# EAGLE design OBD (EAGLE 5.10)
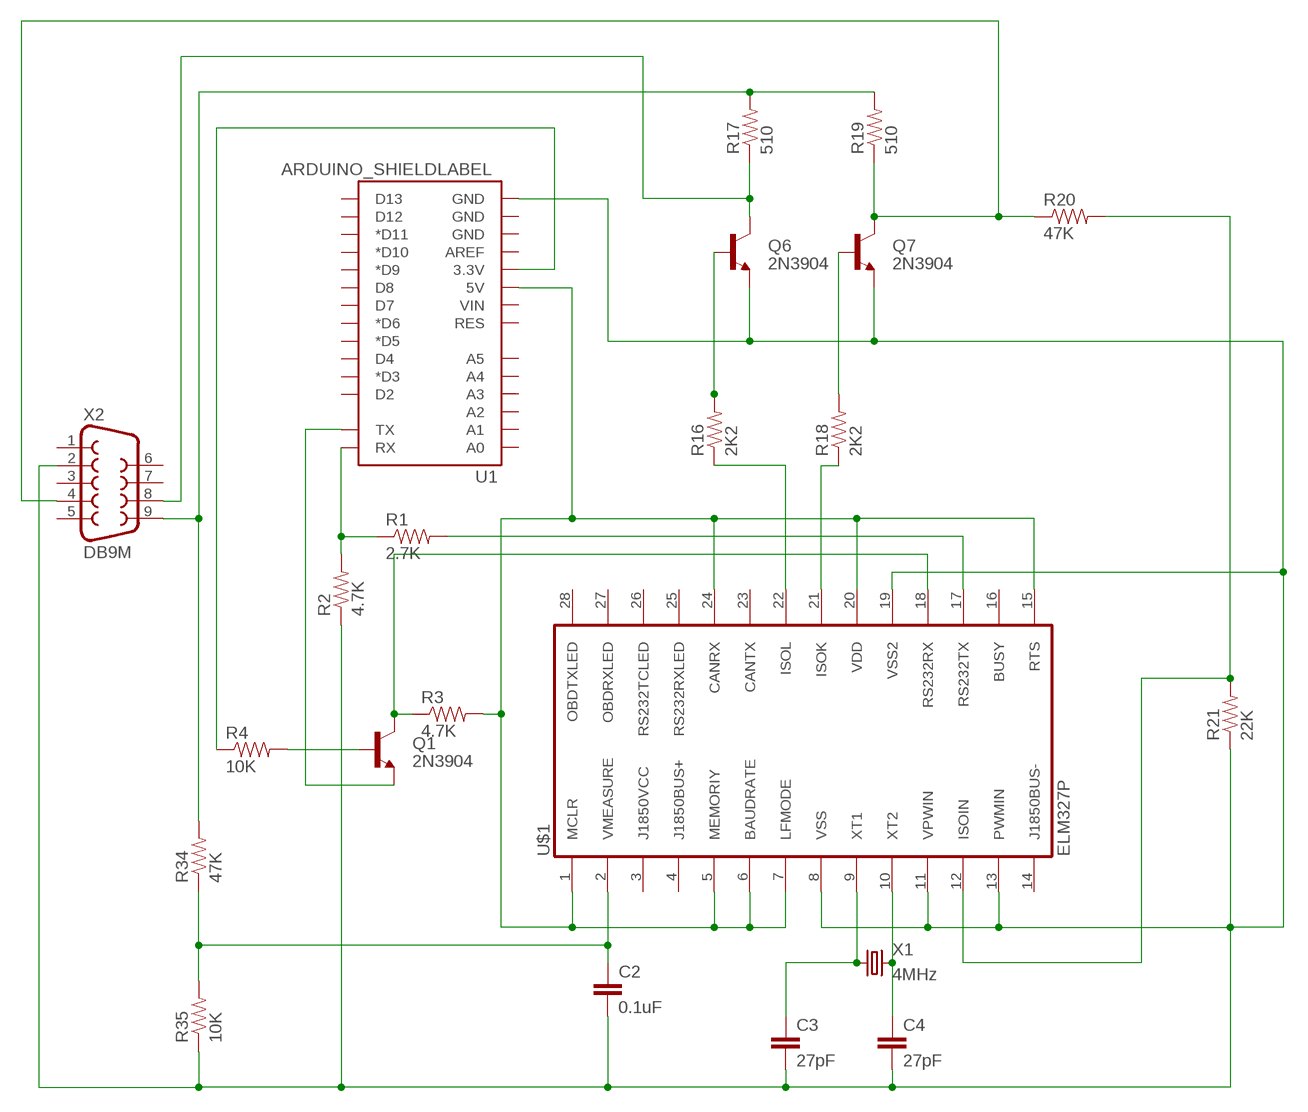
[diagram p0: schematic, sheet 1]

## Parts
C2  0.1uF  CAP_  [AXIAL-5MM]
C3  27pF  CAP_  [AXIAL-5MM]
C4  27pF  CAP_  [AXIAL-5MM]
Q1  2N3904  TRANSISTOR_NPNTO92  [TO-92]
Q6  2N3904  TRANSISTOR_NPNTO92  [TO-92]
Q7  2N3904  TRANSISTOR_NPNTO92  [TO-92]
R1  2.7K  RESISTORPTH1  [AXIAL-0.3]
R2  4.7K  RESISTORPTH1  [AXIAL-0.3]
R3  4.7K  RESISTORPTH1  [AXIAL-0.3]
R4  10K  RESISTORPTH1  [AXIAL-0.3]
R16  2K2  RESISTORPTH1  [AXIAL-0.3]
R17  510  RESISTORPTH1  [AXIAL-0.3]
R18  2K2  RESISTORPTH1  [AXIAL-0.3]
R19  510  RESISTORPTH1  [AXIAL-0.3]
R20  47K  RESISTORPTH1  [AXIAL-0.3]
R21  22K  RESISTORPTH1  [AXIAL-0.3]
R34  47K  RESISTORPTH1  [AXIAL-0.3]
R35  10K  RESISTORPTH1  [AXIAL-0.3]
U1  ARDUINO_SHIELDLABEL  [DUEMILANOVE_SHIELD]
U$1  ELM327P  [ELM327P]
X1  4MHz  CRYSTALHC49UV  [HC49U-V]
X2  DB9M  DB9  [DB9]

## Nets
N$1: C3.P$1 U$1.9(XT1) X1.1
N$2: C4.P$1 U$1.10(XT2) X1.2
N$3: R16.P$1 U$1.22(ISOL)
N$4: Q6.2(B) R16.P$2
N$6: C2.P$1 R34.P$1 R35.P$2 U$1.2(VMEASURE)
N$7: R18.P$1 U$1.21(ISOK)
N$8: Q7.3(C) R19.P$1 R20.P$1 X2.4
N$9: R3.P$2 U1.5V U$1.1(MCLR) U$1.5(MEMORIY) U$1.6(BAUDRATE) U$1.7(LFMODE) U$1.15(RTS) U$1.20(VDD) U$1.24(CANRX)
N$10: Q7.2(B) R18.P$2
N$11: C2.P$2 C3.P$2 C4.P$2 Q6.1(E) Q7.1(E) R2.P$1 R21.P$1 R35.P$1 U1.GND@0(GND) U$1.8(VSS) U$1.11(VPWIN) U$1.13(PWMIN) U$1.19(VSS2) X2.2
N$12: Q6.3(C) R17.P$1 X2.8
N$13: R1.P$2 U$1.17(RS232TX)
N$14: R17.P$2 R19.P$2 R34.P$2 X2.9
N$16: Q1.2(B) R4.P$2
N$17: R20.P$2 R21.P$2 U$1.12(ISOIN)
N$18: Q1.1(E) U1.TX
N$19: R1.P$1 R2.P$2 U1.RX
N$20: R4.P$1 U1.3.3V
N$21: Q1.3(C) R3.P$1 U$1.18(RS232RX)
Unconnected: U1.A0 U1.A1 U1.A2 U1.A3 U1.A4 U1.A5 U1.AREF U1.D2 U1.D3(*D3) U1.D4 U1.D5(*D5) U1.D6(*D6) U1.D7 U1.D8 U1.D9(*D9) U1.D10(*D10) U1.D11(*D11) U1.D12 U1.D13 U1.GND@1(GND) U1.GND@2(GND) U1.RES U1.VIN U$1.3(J1850VCC) U$1.4(J1850BUS+) U$1.14(J1850BUS-) U$1.16(BUSY) U$1.23(CANTX) U$1.25(RS232RXLED) U$1.26(RS232TCLED) U$1.27(OBDRXLED) U$1.28(OBDTXLED) X2.1 X2.3 X2.5 X2.6 X2.7

## Library data of the parts
C2-C4 = SparkFun:CAP: Capacitor Standard 0603 ceramic capacitor, and 0.1" leaded capacitor.
Q1 Q6 Q7 = SparkFun:TRANSISTOR_NPN: Transistor NPN BJT configuration in SOT23 package. MMBT2222 is the common NPN we use. Double check BCE configuration again layout.
R1-R4 R16-R21 R34 R35 = SparkFun:RESISTOR: Resistor Basic schematic elements and footprints for 0603, 1206, and PTH 1/10th watt (small) resistors.
U1 = SparkFun:ARDUINO_SHIELD
U$1 = elm:ELM327P
X1 = SparkFun:CRYSTAL: Crystals Various standard crystals. Proven footprints. Spark Fun Electronics SKU : COM-00534
X2 = SparkFun:DB9: DB9 Connector Standard DB9 (D-Sub 9) serial connector. Can be used for CAN bus as well as RS485 and RS232. Footprint production proven. Spark Fun Electronics SKU : PRT-00429

## Board
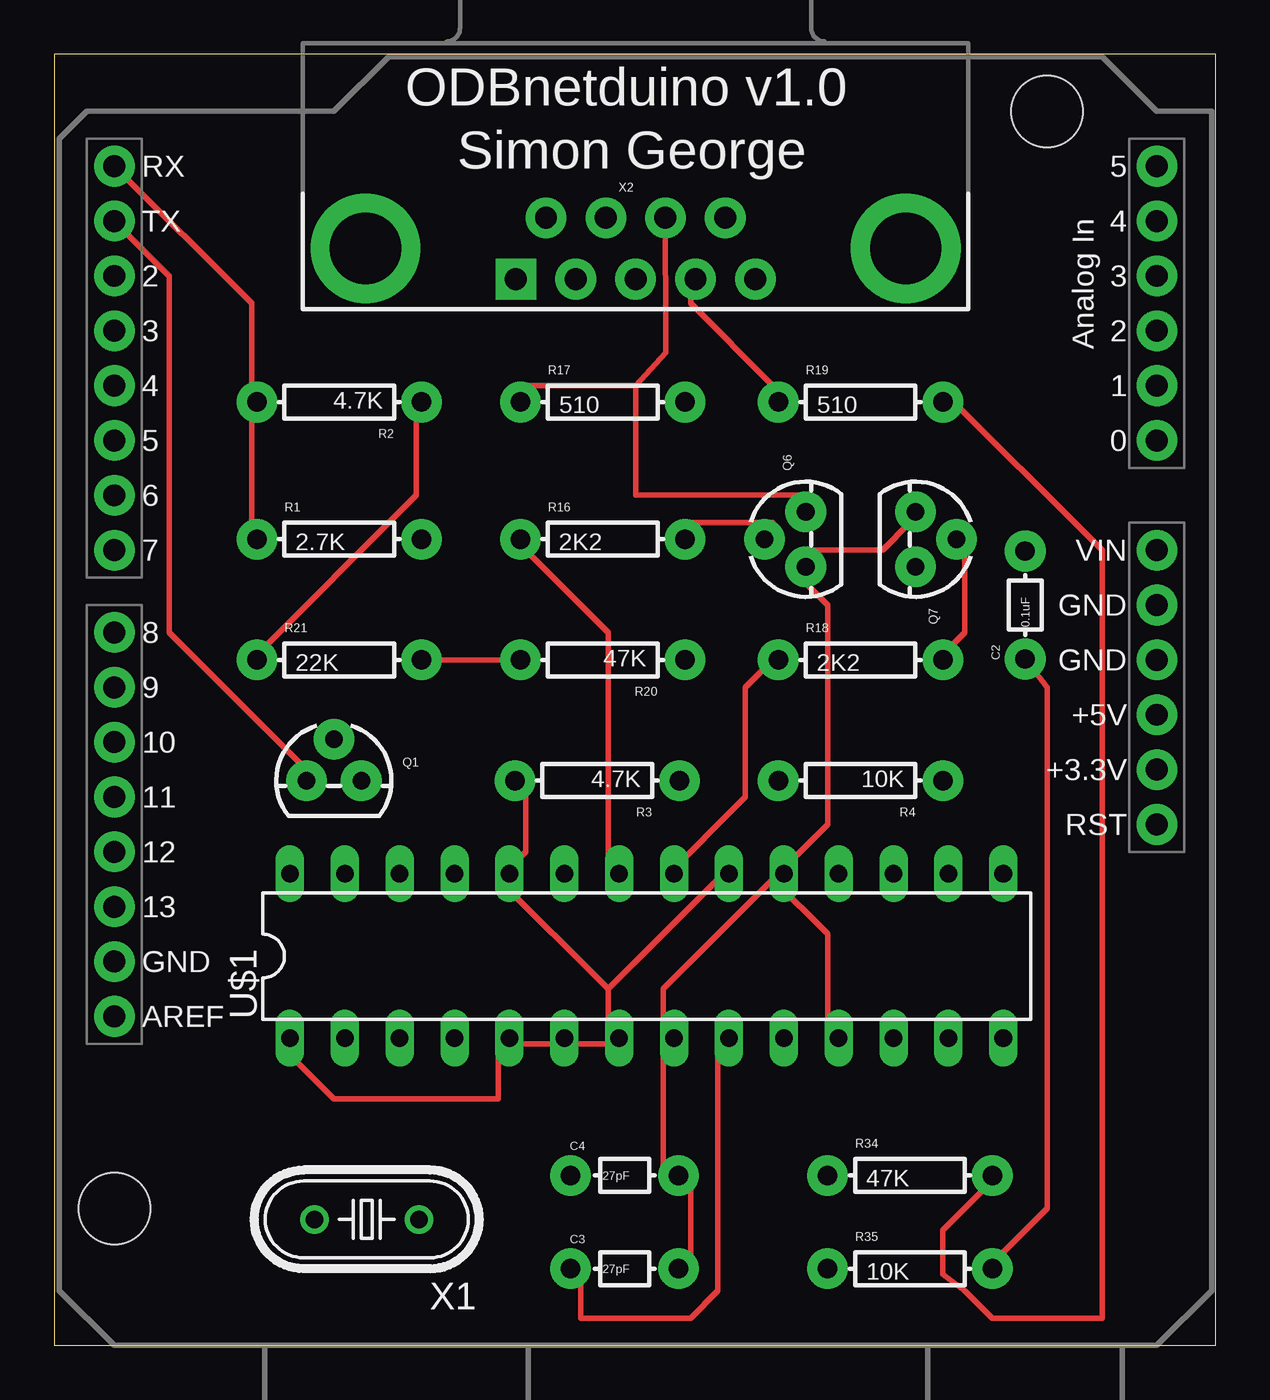
[diagram p1: board, top side]
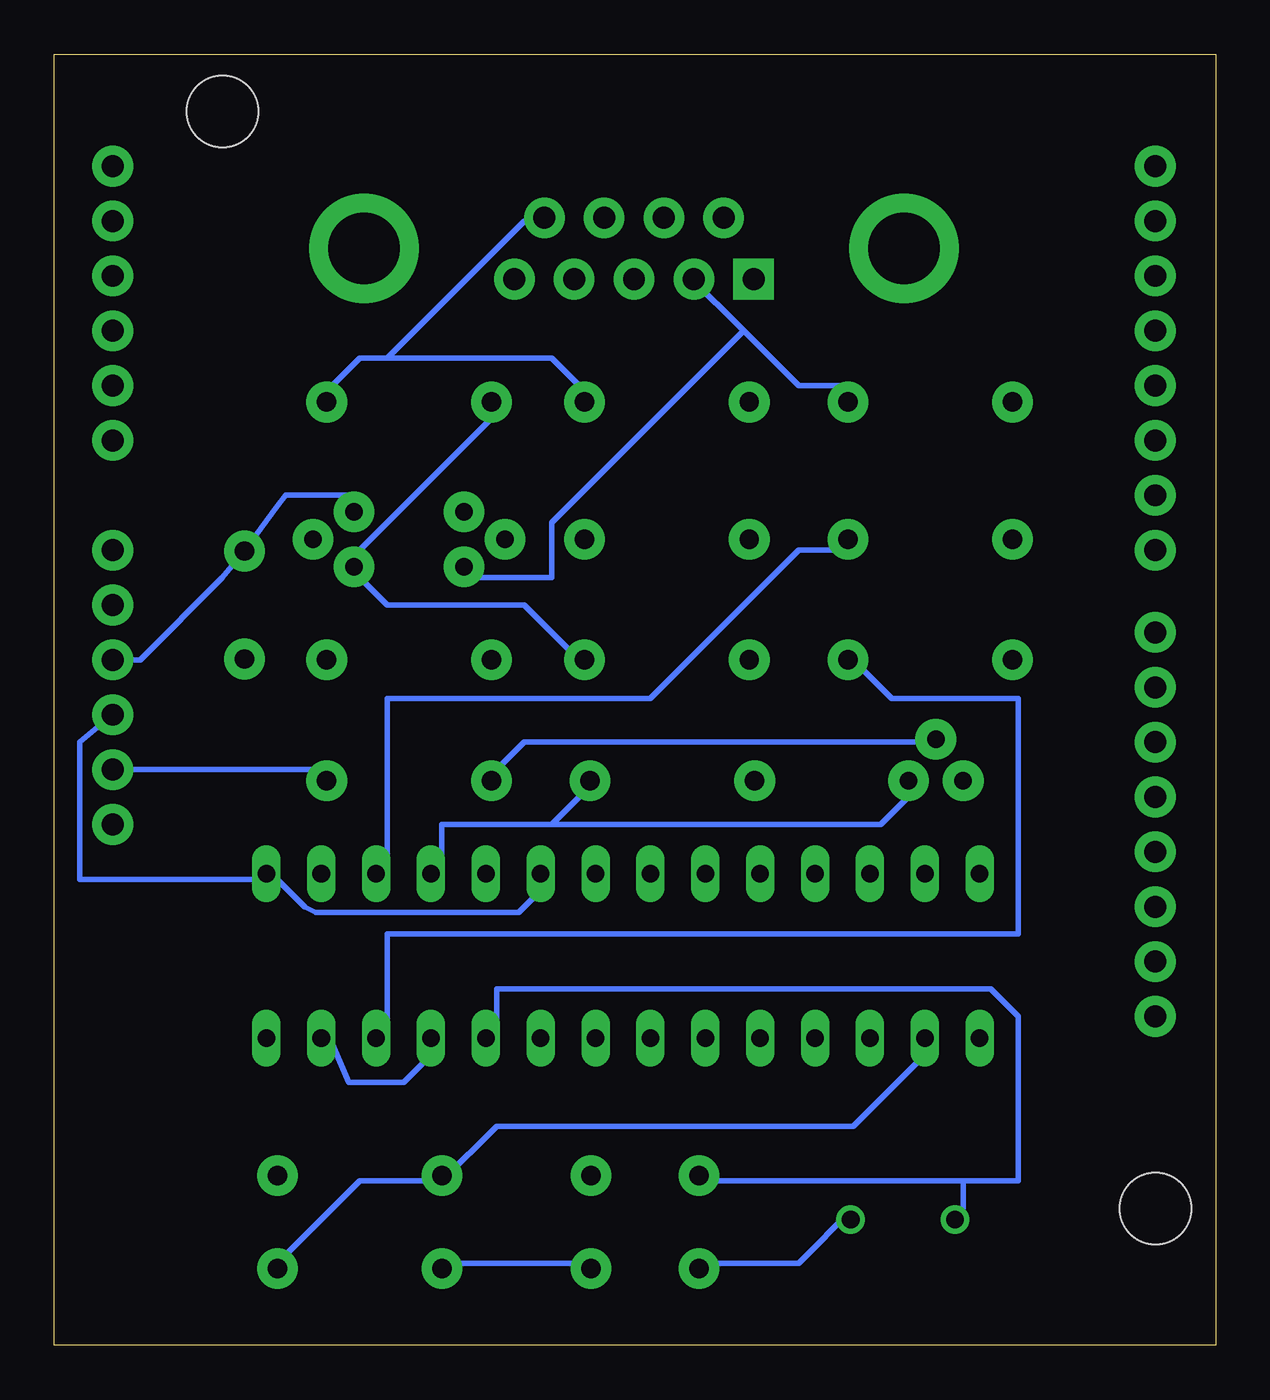
[diagram p2: board, bottom side, seen from below]

Size 53.77 x 59.81 mm. Coordinates in mm from the lower left corner, seen from the top.
Outline: 0,0 53.77,0 53.77,59.81 0,59.81 0,0
Copper layers (1*16): Top 0.035mm / dielectric 1.5mm / Bottom 0.035mm
Design rules "10mils": minimum track width 10mil, minimum drill 24mil, track to track 10mil, track to pad 10mil, pad to pad 10mil, via to via 10mil, smd to smd 10mil, copper to edge 40mil, drill to drill 10mil, minimum pad ring 10mil, minimum via ring 8mil, stop-mask expansion 0mil, vias tented up to drill 0mil, thermal gap 10mil

### Footprints (pad centres in the part's own frame; a part is rotated, then mirrored left to right if it is on the bottom)
AXIAL-5MM = drill 0.9 pad 1.88 round: P$1 -2.5,0; P$2 2.5,0
TO-92 = drill 0.813 pad 1.88 round: 1 -1.27,0; 2 0,1.905; 3 1.27,0
AXIAL-0.3 = drill 0.9 pad 1.88 round: P$1 -3.81,0; P$2 3.81,0
DUEMILANOVE_SHIELD = drill 1.016 pad 1.88 round: 3.3V 50.8,26.67; 5V 50.8,29.21; A0 50.8,41.91; A1 50.8,44.45; A2 50.8,46.99; A3 50.8,49.53; A4 50.8,52.07; A5 50.8,54.61; AREF 2.54,15.24; D2 2.54,49.53; D3 2.54,46.99; D4 2.54,44.45; D5 2.54,41.91; D6 2.54,39.37; D7 2.54,36.83; D8 2.54,33.02; D9 2.54,30.48; D10 2.54,27.94; D11 2.54,25.4; D12 2.54,22.86; D13 2.54,20.32; GND@0 50.8,31.75; GND@1 50.8,34.29; GND@2 2.54,17.78; RES 50.8,24.13; RX 2.54,54.61; TX 2.54,52.07; VIN 50.8,36.83 | hole 3.302: 45.72,57.15; 2.54,6.35
ELM327P = drill 0.813 long: 1 -15.24,-1.27; 2 -12.7,-1.27; 3 -10.16,-1.27; 4 -7.62,-1.27; 5 -5.08,-1.27; 6 -2.54,-1.27; 7 0,-1.27; 8 2.54,-1.27; 9 5.08,-1.27; 10 7.62,-1.27; 11 10.16,-1.27; 12 12.7,-1.27; 13 15.24,-1.27; 14 17.78,-1.27; 15 17.78,6.35; 16 15.24,6.35; 17 12.7,6.35; 18 10.16,6.35; 19 7.62,6.35; 20 5.08,6.35; 21 2.54,6.35; 22 0,6.35; 23 -2.54,6.35; 24 -5.08,6.35; 25 -7.62,6.35; 26 -10.16,6.35; 27 -12.7,6.35; 28 -15.24,6.35
HC49U-V = drill 0.813 round: 1 -2.413,0; 2 2.413,0
DB9 = drill 1.016 pad 1.88 square: 1 -5.54,-1.42 | drill 1.016 pad 1.88 round: 2 -2.77,-1.42; 3 0,-1.42; 4 2.77,-1.42; 5 5.54,-1.42; 6 -4.15,1.42; 7 -1.38,1.42; 8 1.38,1.42; 9 4.15,1.42 | drill 3.302 pad 5.08 round: G1 -12.5,0; G2 12.5,0

### Placement (x,y rotation side)
C2  44.96,34.29 90 top
C3  26.42,3.56 0 top
C4  26.42,7.87 0 top
Q1  12.95,26.16 0 top
Q6  34.8,37.34 90 top
Q7  39.88,37.34 270 top
R1  13.21,37.34 0 top
R2  13.21,43.69 180 top
R3  25.15,26.16 180 top
R4  37.34,26.16 180 top
R16  25.4,37.34 0 top
R17  25.4,43.69 0 top
R18  37.34,31.75 0 top
R19  37.34,43.69 0 top
R20  25.4,31.75 180 top
R21  13.21,31.75 0 top
R34  39.62,7.87 0 top
R35  39.62,3.56 0 top
U1  0.25,0 0 top
U$1  26.16,15.49 0 top
X1  14.48,5.84 180 top
X2  26.92,50.8 0 top

### Tracks (layer width: path | path; a pad name or v marks a point on that pad's centre or on a via)
N$1
  Top 0.254: U$1.9 30.73,13.97 30.73,2.54 29.46,1.27 24.38,1.27 24.38,3.81 C3.P$1
  Bottom 0.254: X1.1 16.76,6.35 19.3,3.81 23.11,3.81 C3.P$1
N$2
  Bottom 0.254: 11.68,7.62 9.14,7.62 9.14,15.24 10.41,16.51 33.27,16.51 33.27,13.97 U$1.10 | 11.68,7.62 23.11,7.62 C4.P$1 | 11.68,7.62 11.68,6.35 X1.2
N$3
  Top 0.254: U$1.22 25.65,21.59 25.65,33.02 21.84,36.83 R16.P$1
N$4
  Top 0.254: R16.P$2 29.46,38.1 33.27,38.1 Q6.2
N$6
  Top 0.254: C2.P$1 45.97,30.48 45.97,6.35 43.43,3.81 R35.P$2
  Bottom 0.254: 35.81,7.62 33.27,10.16 16.76,10.16 12.95,13.97 U$1.2 | 35.81,7.62 39.62,7.62 43.43,3.81 R35.P$2 | 35.81,7.62 R34.P$1
N$7
  Top 0.254: U$1.21 28.19,21.59 32,25.4 32,30.48 33.27,31.75 R18.P$1
N$8
  Top 0.254: R19.P$1 33.27,44.45 29.46,48.26 29.46,49.53 X2.4
  Bottom 0.254: R20.P$1 29.46,31.75 32,34.29 38.35,34.29 39.62,35.56 Q7.3 39.62,36.83 33.27,43.18 R19.P$1
N$9
  Top 0.254: 20.57,21.59 21.84,22.86 21.84,25.4 R3.P$2 | 20.57,13.97 20.57,11.43 12.95,11.43 10.41,13.97 U$1.1 | 20.57,13.97 23.11,13.97 | 20.57,13.97 U$1.5 | 23.11,13.97 25.65,13.97 | 23.11,13.97 U$1.6 | 25.65,16.51 30.73,21.59 U$1.20 | 25.65,13.97 25.65,16.51 | 25.65,13.97 U$1.7 | 25.65,16.51 20.57,21.59 | 20.57,21.59 U$1.24
  Bottom 0.254: 43.43,21.59 42.16,20.32 41.66,20.07 32.26,20.07 30.73,21.59 U$1.20 | 43.43,21.59 U$1.15 | U1.5V 52.58,27.94 52.58,21.59 43.43,21.59
N$10
  Top 0.254: R18.P$2 40.89,31.75 42.16,33.02 42.16,36.83 Q7.2
N$11
  Top 0.254: R21.P$1 9.14,31.75 16.76,39.37 16.76,43.18 R2.P$1 | Q7.1 39.62,38.1 38.35,36.83 34.54,36.83 Q6.1 34.54,35.56 35.81,34.29 35.81,24.13 33.27,21.59 | 33.27,21.59 35.81,19.05 35.81,13.97 U$1.11 | 28.19,13.97 28.19,7.62 C4.P$2 29.46,7.62 29.46,3.81 C3.P$2 | 33.27,21.59 28.19,16.51 28.19,13.97 | 28.19,13.97 U$1.8 | 33.27,21.59 U$1.19
  Bottom 0.254: 21.84,46.99 19.3,44.45 16.76,44.45 R2.P$1 | 21.84,46.99 24.38,49.53 X2.2 | U1.GND@0 49.78,31.75 45.97,35.56 C2.P$2 43.43,38.86 43.05,39.37 39.88,39.37 Q7.1 | U$1.11 35.81,13.97 37.59,12.19 40.13,12.19 40.89,13.97 U$1.13 | R35.P$1 35.81,3.81 29.46,3.81 C3.P$2 | 21.84,46.99 30.73,38.1 30.73,35.56 34.54,35.56 Q6.1
N$12
  Top 0.254: 26.92,44.45 21.84,44.45 R17.P$1 | 28.19,52.07 X2.8 28.32,46.86 28.32,45.97 26.92,44.45 | 26.92,44.45 26.92,39.37 34.54,39.37 Q6.3
N$13
  Bottom 0.254: U$1.17 38.35,21.59 38.35,29.97 26.16,29.97 19.3,36.83 16.76,36.83 R1.P$2
N$14
  Top 0.254: R34.P$2 43.43,7.62 41.15,5.33 41.15,3.3 42.16,2.54 43.43,1.27 48.51,1.27 48.51,36.83 40.89,44.45 R19.P$2
  Bottom 0.254: 38.35,45.72 39.62,45.72 40.89,44.45 R19.P$2 | 38.35,45.72 30.73,45.72 29.46,44.45 R17.P$2 | 38.35,45.72 32,52.07 X2.9
N$16
  Bottom 0.254: Q1.2 12.95,27.94 32,27.94 33.27,26.67 R4.P$2
N$17
  Top 0.254: 21.84,31.75 R20.P$2 R21.P$2 16.76,31.75
  Bottom 0.254: U$1.12 38.35,13.97 38.35,19.05 9.14,19.05 9.14,29.97 14.99,29.97 16.76,31.75 R21.P$2
N$18
  Top 0.254: Q1.1 11.68,26.67 5.33,33.02 5.33,49.53 U1.TX
N$19
  Top 0.254: R1.P$1 9.14,38.1 9.14,43.18 R2.P$2 9.14,44.45 9.14,48.26 U1.RX
N$20
  Bottom 0.254: U1.3.3V 40.89,26.67 R4.P$1
N$21
  Bottom 0.254: 30.73,24.13 35.81,24.13 35.81,21.59 U$1.18 | 30.73,24.13 29.46,25.4 R3.P$1 | 30.73,24.13 15.49,24.13 14.22,25.4 Q1.3

### Text on the board
tPlace: ODBnetduino v1.0 | Simon George